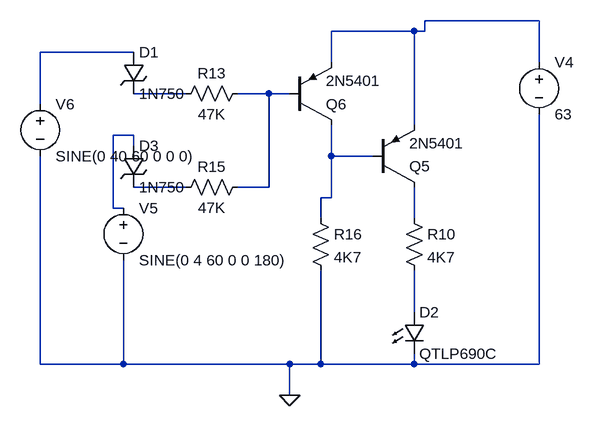
[diagram p0: schematic ZenPreamp.asc]
ZenPreamp.asc, the LTspice schematic file:
Version 4
SHEET 1 1172 868
WIRE -528 32 -704 32
WIRE -720 48 -848 48
WIRE -704 48 -704 32
WIRE -704 48 -720 48
WIRE -1152 80 -1296 80
WIRE -848 96 -848 48
WIRE -528 96 -528 32
WIRE -1072 144 -1152 144
WIRE -944 144 -992 144
WIRE -912 144 -944 144
WIRE -1296 160 -1296 80
WIRE -720 192 -720 48
WIRE -1152 208 -1184 208
WIRE -1152 224 -1152 208
WIRE -848 240 -848 192
WIRE -784 240 -848 240
WIRE -1072 288 -1152 288
WIRE -944 288 -944 144
WIRE -944 288 -992 288
WIRE -848 304 -848 240
WIRE -848 304 -864 304
WIRE -1184 320 -1184 208
WIRE -1168 320 -1184 320
WIRE -864 336 -864 304
WIRE -720 336 -720 288
WIRE -720 480 -720 416
WIRE -1296 560 -1296 240
WIRE -1168 560 -1168 400
WIRE -1168 560 -1296 560
WIRE -912 560 -1168 560
WIRE -864 560 -864 416
WIRE -864 560 -912 560
WIRE -720 560 -720 544
WIRE -720 560 -864 560
WIRE -528 560 -528 176
WIRE -528 560 -720 560
WIRE -912 608 -912 560
FLAG -912 608 0
SYMBOL LED -736 480 R0
SYMATTR InstName D2
SYMATTR Value QTLP690C
SYMBOL res -736 320 R0
SYMATTR InstName R10
SYMATTR Value 4K7
SYMBOL pnp -784 288 M180
SYMATTR InstName Q5
SYMATTR Value 2N5401
SYMBOL pnp -912 192 M180
SYMATTR InstName Q6
SYMATTR Value 2N5401
SYMBOL res -976 128 R90
WINDOW 0 0 56 VBottom 2
WINDOW 3 32 56 VTop 2
SYMATTR InstName R13
SYMATTR Value 47K
SYMBOL res -976 272 R90
WINDOW 0 0 56 VBottom 2
WINDOW 3 32 56 VTop 2
SYMATTR InstName R15
SYMATTR Value 47K
SYMBOL res -880 320 R0
SYMATTR InstName R16
SYMATTR Value 4K7
SYMBOL voltage -528 80 R0
WINDOW 123 24 126 Left 2
WINDOW 39 24 111 Left 2
SYMATTR InstName V4
SYMATTR Value 63
SYMBOL voltage -1168 304 R0
WINDOW 123 24 126 Left 2
WINDOW 39 24 111 Left 2
SYMATTR InstName V5
SYMATTR Value SINE(0 4 60 0 0 180)
SYMBOL voltage -1296 144 R0
WINDOW 123 24 126 Left 2
WINDOW 39 24 111 Left 2
SYMATTR InstName V6
SYMATTR Value SINE(0 40 60 0 0 0)
SYMBOL zener -1168 80 R0
SYMATTR InstName D1
SYMATTR Value 1N750
SYMBOL zener -1168 224 R0
SYMATTR InstName D3
SYMATTR Value 1N750

The netlist it stands for:
* ZenPreamp.asc
D2 N009 0 QTLP690C
R10 N008 N009 4K7
Q5 N008 N006 N001 0 2N5401
Q6 N006 N004 N001 0 2N5401
R13 N004 N003 47K
R15 N004 N007 47K
R16 N006 0 4K7
V4 N001 0 63
V5 N005 0 SINE(0 4 60 0 0 180)
V6 N002 0 SINE(0 40 60 0 0 0)
D1 N002 N003 1N750
D3 N005 N007 1N750
.model D D
.lib standard.dio
.model NPN NPN
.model PNP PNP
.lib standard.bjt
.backanno
.end